# Altium schematic sheet 18-OSPI FLASH AND SPI NOR FLASH.SchDoc
size 513 x 386 mm
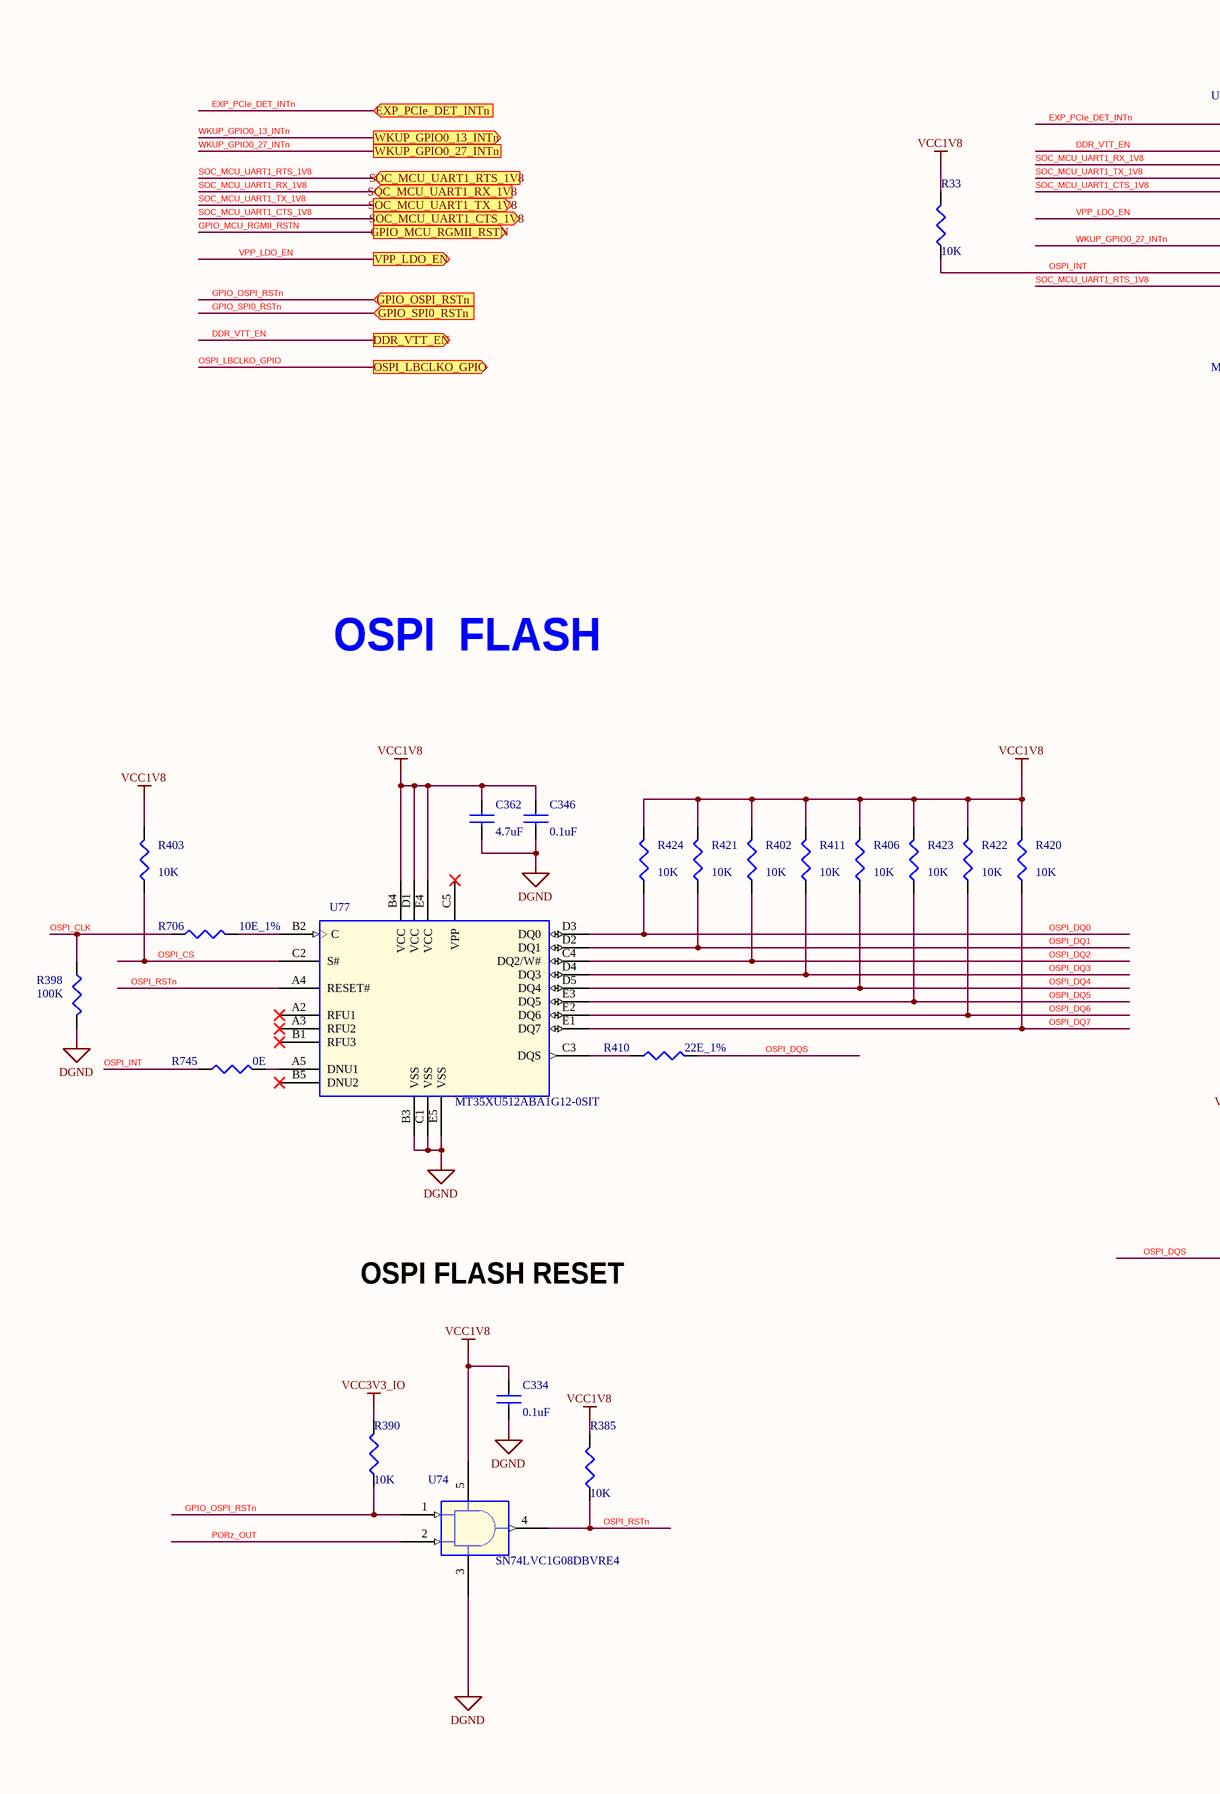
[diagram p0: 18-OSPI FLASH AND SPI NOR FLASH.SchDoc, left]
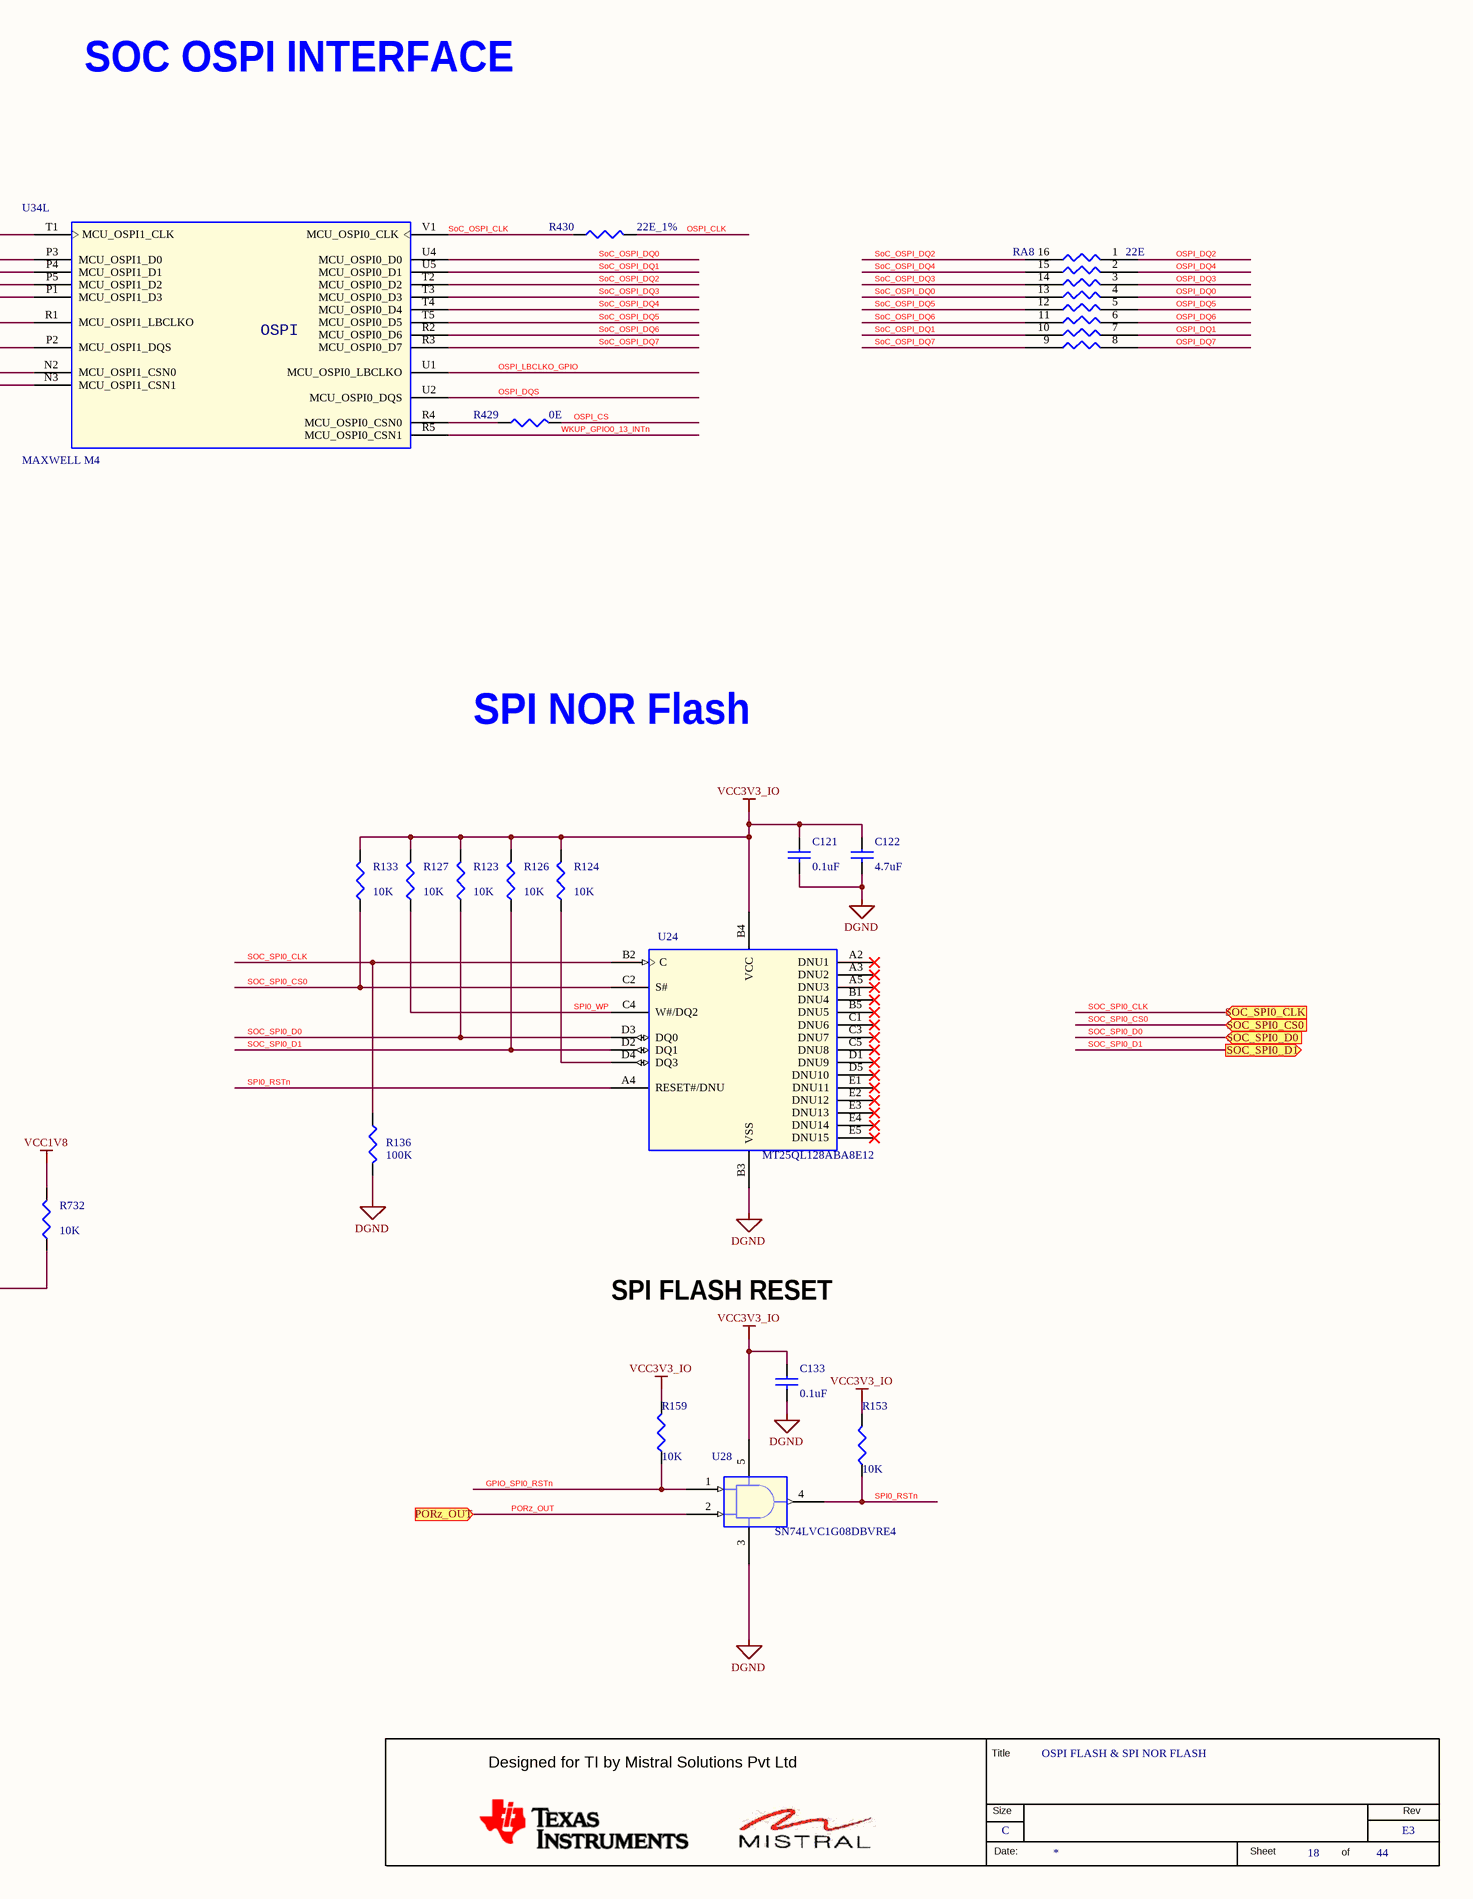
[diagram p1: 18-OSPI FLASH AND SPI NOR FLASH.SchDoc, right]

## Parts
*  RevCode: E3  Title: OSPI FLASH & SPI NOR FLASH  Page Size: C  Page Number: 18  Page Count: 44  (hidden comment: MISTRAL_TITLEBLK_CSIZE)  (graphical)
C121  0.1uF  [CAP0201_0-5]
C122  4.7uF  [CAP0402_0-75]
C133  0.1uF  [CAP0201_0-5]
C334  0.1uF  [CAP0201_0-5]
C346  0.1uF  [CAP0201_0-5]
C362  4.7uF  [CAP0402_0-75]
R33  10K  [RES0402_0-5]
R123  10K  [RES0402_0-5]
R124  10K  [RES0402_0-5]
R126  10K  [RES0402_0-5]
R127  10K  [RES0402_0-5]
R133  10K  [RES0402_0-5]
R136  100K  [RES0402_0-5]
R153  10K  [RES0402_0-5]
R159  10K  [RES0402_0-5]
R385  10K  [RES0402_0-5]
R390  10K  [RES0402_0-5]
R398  100K  [RES0402_0-5]
R402  10K  [RES0402_0-5]
R403  10K  [RES0402_0-5]
R406  10K  [RES0402_0-5]
R410  22E_1%  [RES0402]
R411  10K  [RES0402_0-5]
R420  10K  [RES0402_0-5]
R421  10K  [RES0402_0-5]
R422  10K  [RES0402_0-5]
R423  10K  [RES0402_0-5]
R424  10K  [RES0402_0-5]
R429  0E  [RES0402_0-5]
R430  22E_1%  [RES0402]
R706  10E_1%  [RES0402_0-5]
R732  10K  [RES0402_0-5]
R745  0E  [RES0402_0-5]
RA8  22E  [RESA_0402-8]
U24  MT25QL128ABA8E12  [TPBGA24_39-37_240X320_1-2]
U28  SN74LVC1G08DBVRE4  [SOT23-5]
U34  MAXWELL M4  [BGA784_31-49_910X910_1-7]  (part L of 19)
U74  SN74LVC1G08DBVRE4  [SOT23-5]
U77  MT35XU512ABA1G12-0SIT  [TPBGA24_39-37_240X320_1-2]

## Ports
DDR_VTT_EN (out), EXP_PCIe_DET_INTn (in), GPIO_MCU_RGMII_RSTN (out), GPIO_OSPI_RSTn (in), GPIO_SPI0_RSTn (in), OSPI_LBCLKO_GPIO (out), PORz_OUT (in), SOC_MCU_UART1_CTS_1V8 (out), SOC_MCU_UART1_RTS_1V8 (in), SOC_MCU_UART1_RX_1V8 (in), SOC_MCU_UART1_TX_1V8 (out), SOC_SPI0_CLK (in), SOC_SPI0_CS0 (in), SOC_SPI0_D0 (in), SOC_SPI0_D1 (out), VPP_LDO_EN (out), WKUP_GPIO0_13_INTn (out), WKUP_GPIO0_27_INTn

## Nets
DGND: C121.2 C122.2 C133.2 C334.2 C346.2 C362.2 R136.2 R398.2 U24.B3(VSS) U28.3(GND) U74.3(GND) U77.B3(VSS) U77.C1(VSS) U77.E5(VSS)
VCC1V8: C334.1 C346.1 C362.1 R33.2 R385.2 R402.2 R403.2 R406.2 R411.2 R420.2 R421.2 R422.2 R423.2 R424.2 R732.2 U74.5(VCC) U77.B4(VCC) U77.D1(VCC) U77.E4(VCC)
VCC3V3_IO: C121.1 C122.1 C133.1 R123.2 R124.2 R126.2 R127.2 R133.2 R153.2 R159.2 R390.2 U24.B4(VCC) U28.5(VCC)
DDR_VTT_EN: U34.P3(MCU_OSPI1_D0) ; port DDR_VTT_EN
EXP_PCIe_DET_INTn: U34.T1(MCU_OSPI1_CLK) ; port EXP_PCIe_DET_INTn
GPIO_MCU_RGMII_RSTN: port GPIO_MCU_RGMII_RSTN
GPIO_OSPI_RSTn: R390.1 U74.1(A) ; port GPIO_OSPI_RSTn
GPIO_SPI0_RSTn: R159.1 U28.1(A) ; port GPIO_SPI0_RSTn
OSPI_CLK: R398.1 R430.2 R706.1
OSPI_CS: R403.1 R429.2 U77.C2(S#)
OSPI_DQ0: R424.1 RA8.4 U77.D3(DQ0)
OSPI_DQ1: R421.1 RA8.7 U77.D2(DQ1)
OSPI_DQ2: R402.1 RA8.1 U77.C4(DQ2/W#)
OSPI_DQ3: R411.1 RA8.3 U77.D4(DQ3)
OSPI_DQ4: R406.1 RA8.2 U77.D5(DQ4)
OSPI_DQ5: R423.1 RA8.5 U77.E3(DQ5)
OSPI_DQ6: R422.1 RA8.6 U77.E2(DQ6)
OSPI_DQ7: R420.1 RA8.8 U77.E1(DQ7)
OSPI_DQS: R410.2 R732.1 U34.U2(MCU_OSPI0_DQS)
OSPI_INT: R33.1 R745.1 U34.N2(MCU_OSPI1_CSN0)
OSPI_LBCLKO_GPIO: U34.U1(MCU_OSPI0_LBCLKO) ; port OSPI_LBCLKO_GPIO
OSPI_RSTn: R385.1 U74.4(Y) U77.A4(RESET#)
PORz_OUT: U28.2(B) U74.2(B) ; port PORz_OUT
SOC_MCU_UART1_CTS_1V8: U34.P1(MCU_OSPI1_D3) ; port SOC_MCU_UART1_CTS_1V8
SOC_MCU_UART1_RTS_1V8: U34.N3(MCU_OSPI1_CSN1) ; port SOC_MCU_UART1_RTS_1V8
SOC_MCU_UART1_RX_1V8: U34.P4(MCU_OSPI1_D1) ; port SOC_MCU_UART1_RX_1V8
SOC_MCU_UART1_TX_1V8: U34.P5(MCU_OSPI1_D2) ; port SOC_MCU_UART1_TX_1V8
SoC_OSPI_CLK: R430.1 U34.V1(MCU_OSPI0_CLK)
SoC_OSPI_DQ0: RA8.13 U34.U4(MCU_OSPI0_D0)
SoC_OSPI_DQ1: RA8.10 U34.U5(MCU_OSPI0_D1)
SoC_OSPI_DQ2: RA8.16 U34.T2(MCU_OSPI0_D2)
SoC_OSPI_DQ3: RA8.14 U34.T3(MCU_OSPI0_D3)
SoC_OSPI_DQ4: RA8.15 U34.T4(MCU_OSPI0_D4)
SoC_OSPI_DQ5: RA8.12 U34.T5(MCU_OSPI0_D5)
SoC_OSPI_DQ6: RA8.11 U34.R2(MCU_OSPI0_D6)
SoC_OSPI_DQ7: RA8.9 U34.R3(MCU_OSPI0_D7)
SOC_SPI0_CLK: R136.1 U24.B2(C) ; port SOC_SPI0_CLK
SOC_SPI0_CS0: R133.1 U24.C2(S#) ; port SOC_SPI0_CS0
SOC_SPI0_D0: R123.1 U24.D3(DQ0) ; port SOC_SPI0_D0
SOC_SPI0_D1: R126.1 U24.D2(DQ1) ; port SOC_SPI0_D1
SPI0_RSTn: R153.1 U24.A4(RESET#/DNU) U28.4(Y)
SPI0_WP: R127.1 U24.C4(W#/DQ2)
VPP_LDO_EN: U34.R1(MCU_OSPI1_LBCLKO) ; port VPP_LDO_EN
WKUP_GPIO0_13_INTn: U34.R5(MCU_OSPI0_CSN1) ; port WKUP_GPIO0_13_INTn
WKUP_GPIO0_27_INTn: U34.P2(MCU_OSPI1_DQS) ; port WKUP_GPIO0_27_INTn
NetR124_1: R124.1 U24.D4(DQ3)
NetR410_1: R410.1 U77.C3(DQS)
NetR429_1: R429.1 U34.R4(MCU_OSPI0_CSN0)
NetR706_2: R706.2 U77.B2(C)
NetR745_2: R745.2 U77.A5(DNU1)

Not connected (* = marked no-connect by the designer): U24 A2(DNU1)* A3(DNU2)* A5(DNU3)* B1(DNU4)* B5(DNU5)* C1(DNU6)* C3(DNU7)* C5(DNU8)* D1(DNU9)* D5(DNU10)* E1(DNU11)* E2(DNU12)* E3(DNU13)* E4(DNU14)* E5(DNU15)*; U77 A2(RFU1)* A3(RFU2)* B1(RFU3)* B5(DNU2)* C5(VPP)*

## Notes on the sheet
- SOC OSPI INTERFACE
- OSPI  FLASH
- SPI NOR Flash
- OSPI FLASH RESET
- SPI FLASH RESET
- (in symbol AM654X_BGA784, part L) OSPI
- (in symbol MISTRAL_TITLEBLK_CSIZE) Title; Designed for TI by Mistral Solutions Pvt Ltd; Size; Rev; Date:; Sheet; of

## Library data of the parts
* = MISTRAL_TITLEBLK_CSIZE: Issue: 1.0; Page Create Date: March  8, 1995; Page Modify Date: *
C121 C334 C346 = CAP_Dup5: CAP CERAMIC 0.1uF 16V 10% X5R 0201; Part_type: CAPACITORS\CERAMIC; Mfr_part_number: GRM033R61C104KE84J; Mfr_name: MURATA; Mistral Part No: 120009030072-R; Custom_Duty: 15%; Customs_HS_Code: 85322990; Wattage: NA; Project: TI_MAXIE_CPB; Library Ref: CAP; PCB Footprint: CAP0201_0-5; MECHANICAL 3D STEP FILE: CAP0201_0-5; Chkd/date: MANIRAJA/120218; Crtd /date: MANIRAJA/120218; Datasheet: Y:\MIS_DATABASE\DATASHEETS\CAPACITORS\GRM033R61C104KE84.PDF; Temperature: -55°C+85°C; Weight: 0.33mg; Height: 0.33MM; Distributor_part_number: 490-16742-1-ND; Distributor_name: DIGIKEY; Package: 0201; Voltage: 16V; Tolerance: 10%
C122 = CAP_Dup5: CAP CERAMIC 4.7uF 10V 20% X5R 0402; Mistral Part No: 120012060002-R; Mfr_name: AVX CORPORATION; Mfr_part_number: 0402ZD475MAT2A; Part_type: CAPACITORS\CERAMIC; Project: TI_MAXIE_CPB; Wattage: NA; Customs_HS_Code: 85322990; Custom_Duty: 15%; Library Ref: CAP; PCB Footprint: CAP0402_0-75; Tolerance: 20%; Voltage: 10V; Package: 0402; Distributor_name: DIGIKEY; Distributor_part_number: 478-10791-1-ND; Height: 0.71MM; Weight: 0.65mg; Temperature: -55°C+85°C; Datasheet: Y:\MIS_DATABASE\DATASHEETS\CAPACITORS\AVX_MLC.PDF; Crtd /date: MANIRAJA/230118; Chkd/date: MANIRAJA/230118; MECHANICAL 3D STEP FILE: CAP0402_0-75
C133 = CAP_Dup5: CAP CERAMIC 0.1uF 16V 10% X5R 0201; Mistral Part No: 120009030072-R; Mfr_name: MURATA; Mfr_part_number: GRM033R61C104KE84J; Part_type: CAPACITORS\CERAMIC; Project: TI_MAXIE_CPB; Wattage: NA; Customs_HS_Code: 85322990; Custom_Duty: 15%; Library Ref: CAP; PCB Footprint: CAP0201_0-5; Tolerance: 10%; Voltage: 16V; Package: 0201; Distributor_name: DIGIKEY; Distributor_part_number: 490-16742-1-ND; Height: 0.33MM; Weight: 0.33mg; Temperature: -55°C+85°C; Datasheet: Y:\MIS_DATABASE\DATASHEETS\CAPACITORS\GRM033R61C104KE84.PDF; Crtd /date: MANIRAJA/120218; Chkd/date: MANIRAJA/120218; MECHANICAL 3D STEP FILE: CAP0201_0-5
C362 = CAP_Dup5: CAP CERAMIC 4.7uF 10V 20% X5R 0402; Part_type: CAPACITORS\CERAMIC; Mfr_part_number: 0402ZD475MAT2A; Mfr_name: AVX CORPORATION; Mistral Part No: 120012060002-R; Custom_Duty: 15%; Customs_HS_Code: 85322990; Wattage: NA; Project: TI_MAXIE_CPB; Library Ref: CAP; PCB Footprint: CAP0402_0-75; MECHANICAL 3D STEP FILE: CAP0402_0-75; Chkd/date: MANIRAJA/230118; Crtd /date: MANIRAJA/230118; Datasheet: Y:\MIS_DATABASE\DATASHEETS\CAPACITORS\AVX_MLC.PDF; Temperature: -55°C+85°C; Weight: 0.65mg; Height: 0.71MM; Distributor_part_number: 478-10791-1-ND; Distributor_name: DIGIKEY; Package: 0402; Voltage: 10V; Tolerance: 20%
R33 R124 R126 R127 R159 R385 R403 = RESISTOR_Dup5: RES 10K 1/16W 5% 0402; Part_type: RESISTORS\FIXED; Mfr_part_number: RC0402JR-0710KL; Mfr_name: YAGEO AMERICA; Mistral Part No: 110009030208-R; Custom_Duty: 15%; Customs_HS_Code: 85332119; Voltage: NA; Project: HSE; Footprint Path: Y:\MIS_DATABASE\Library\ALTIUM_TOOL\PCB_FOOTPRINTS\Altium_Footprint_Lib.PcbLib; Library Path: Y:\MIS_DATABASE\Library\ALTIUM_TOOL\SCHEMATICS_PARTS\MS_DISCRETE_Library.schlib; Footprint Ref: RES0402_0-5; Library Ref: RESISTOR; PCB Footprint: RES0402_0-5; MECHANICAL 3D STEP FILE: RES0402_0-5; RoHS: Pb-Free; Chkd/date: VASANTHA/061216; Crtd /date: MAZHAR/230805; Datasheet: Y:\MIS_DATABASE\DATASHEETS\RESISTORS\YAGEO-RC0402.PDF; Temperature: -55°C+155°C; Weight: 0.65mg; Height: 0.40MM; Distributor_part_number: 311-10KJRCT-ND; Distributor_name: DIGIKEY; Package: 0402; Wattage: 1/16W; Tolerance: 5%
R123 R133 R153 R390 R402 = RESISTOR_Dup5: RES 10K 1/16W 5% 0402; Mistral Part No: 110009030208-R; Mfr_name: YAGEO AMERICA; Mfr_part_number: RC0402JR-0710KL; Part_type: RESISTORS\FIXED; Project: HSE; Voltage: NA; Customs_HS_Code: 85332119; Custom_Duty: 15%; Footprint Path: Y:\MIS_DATABASE\Library\ALTIUM_TOOL\PCB_FOOTPRINTS\Altium_Footprint_Lib.PcbLib; Library Path: Y:\MIS_DATABASE\Library\ALTIUM_TOOL\SCHEMATICS_PARTS\MS_DISCRETE_Library.schlib; Footprint Ref: RES0402_0-5; Library Ref: RESISTOR; Tolerance: 5%; Wattage: 1/16W; Package: 0402; Distributor_name: DIGIKEY; Distributor_part_number: 311-10KJRCT-ND; Height: 0.40MM; Weight: 0.65mg; Temperature: -55°C+155°C; Datasheet: Y:\MIS_DATABASE\DATASHEETS\RESISTORS\YAGEO-RC0402.PDF; Crtd /date: MAZHAR/230805; Chkd/date: VASANTHA/061216; RoHS: Pb-Free; MECHANICAL 3D STEP FILE: RES0402_0-5; PCB Footprint: RES0402_0-5
R136 R398 = RESISTOR_Dup4: RES 100K 1/16W 5% 0402; Mistral Part No: 110011060002-R; Mfr_name: VISHAY; Mfr_part_number: CRCW0402100KJNED; Part_type: RESISTORS\FIXED; Project: AM4515_EVM_LCD; Voltage: NA; Customs_HS_Code: 85332119; Custom_Duty: 15%; Library Ref: RESISTOR; Tolerance: 5%; Wattage: 1/16W; Package: 0402; Distributor_name: DIGIKEY; Distributor_part_number: 541-100KJCT-ND; Height: 0.40MM; Weight: 0.65mg; Temperature: -55°C+155°C; Datasheet: Y:\MIS_DATABASE\DATASHEETS\RESISTORS\CRCW0603.PDF; Crtd /date: BAVISH/010611; Chkd/date: VASANTHA/061216; PCB Footprint: RES0402_0-5; MECHANICAL 3D STEP FILE: RES0402_0-5
R406 R420 R423 = RESISTOR_Dup5: RES 10K 1/16W 5% 0402; Mistral Part No: 110009030208-R; Mfr_name: YAGEO AMERICA; Mfr_part_number: RC0402JR-0710KL; Part_type: RESISTORS\FIXED; Project: HSE; Voltage: NA; Customs_HS_Code: 85332119; Custom_Duty: 15%; NI_MARK: DNI; Footprint Path: Y:\MIS_DATABASE\Library\ALTIUM_TOOL\PCB_FOOTPRINTS\Altium_Footprint_Lib.PcbLib; Library Path: Y:\MIS_DATABASE\Library\ALTIUM_TOOL\SCHEMATICS_PARTS\MS_DISCRETE_Library.schlib; Footprint Ref: RES0402_0-5; Library Ref: RESISTOR; PCB Footprint: RES0402_0-5; Tolerance: 5%; Wattage: 1/16W; Package: 0402; Distributor_name: DIGIKEY; Distributor_part_number: 311-10KJRCT-ND; Height: 0.40MM; Weight: 0.65mg; Temperature: -55°C+155°C; Datasheet: Y:\MIS_DATABASE\DATASHEETS\RESISTORS\YAGEO-RC0402.PDF; Crtd /date: MAZHAR/230805; Chkd/date: VASANTHA/061216; RoHS: Pb-Free; MECHANICAL 3D STEP FILE: RES0402_0-5
R410 = RESISTOR_Dup4: RES 22E 1/16W 1% 0402; Mistral Part No: 110009090004-P; Mfr_name: YAGEO AMERICA; Mfr_part_number: RC0402FR-0722RL; Part_type: RESISTORS\FIXED; Alternate_mfr_name_A: VISHAY; Alternate_mfr_part_number_A: CRCW040222R0FKED; Cust_part_number: 4700-80047E; SIGNAL_MODEL: RESISTOR_RES0402_22E_22E; Project: VMEFMCD; Voltage: 50V; Customs_HS_Code: 85332119; Custom_Duty: 15%; Remarks: In alternate datasheet it is RoHS COMPLIANT. Y:\MIS_DATABASE\DATASHEETS\RESISTORS\CRCW0402.PDF; Library Ref: RESISTOR; PCB Footprint: RES0402; Tolerance: 1%; Wattage: 1/16W; Package: 0402; Distributor_name: DIGIKEY; Distributor_part_number: 311-22.0LRCT-ND; Distributor_name_A: DIGIKEY; Distributor_part_number_A: 541-22.0LCT-ND; Height: 0.40MM; Weight: 0.8g/1000pcs; Temperature: -55°C+155°C; Datasheet: Y:\MIS_DATABASE\DATASHEETS\RESISTORS\YAGEO-RC0402.PDF; Crtd /date: MAZHAR/090909; Chkd/date: SUHAS/290910; RoHS: Pb-Free
R411 R421 R422 R424 R732 = RESISTOR_Dup5: RES 10K 1/16W 5% 0402; Part_type: RESISTORS\FIXED; Mfr_part_number: RC0402JR-0710KL; Mfr_name: YAGEO AMERICA; Mistral Part No: 110009030208-R; Custom_Duty: 15%; Customs_HS_Code: 85332119; Voltage: NA; Project: HSE; NI_MARK: DNI; Footprint Path: Y:\MIS_DATABASE\Library\ALTIUM_TOOL\PCB_FOOTPRINTS\Altium_Footprint_Lib.PcbLib; Library Path: Y:\MIS_DATABASE\Library\ALTIUM_TOOL\SCHEMATICS_PARTS\MS_DISCRETE_Library.schlib; Footprint Ref: RES0402_0-5; Library Ref: RESISTOR; PCB Footprint: RES0402_0-5; MECHANICAL 3D STEP FILE: RES0402_0-5; RoHS: Pb-Free; Chkd/date: VASANTHA/061216; Crtd /date: MAZHAR/230805; Datasheet: Y:\MIS_DATABASE\DATASHEETS\RESISTORS\YAGEO-RC0402.PDF; Temperature: -55°C+155°C; Weight: 0.65mg; Height: 0.40MM; Distributor_part_number: 311-10KJRCT-ND; Distributor_name: DIGIKEY; Package: 0402; Wattage: 1/16W; Tolerance: 5%
R429 R745 = RESISTOR_Dup4: RES 0E 1/16W 0402; Mistral Part No: 110010080019-P; Mfr_name: VISHAY; Mfr_part_number: CRCW04020000Z0ED; Part_type: RESISTORS\FIXED; Project: PB_BUGBASE; Tolerance: NA; Customs_HS_Code: 85332119; Custom_Duty: 15%; Footprint Path: Y:\MIS_DATABASE\Library\ALTIUM_TOOL\PCB_FOOTPRINTS\Altium_Footprint_Lib.PcbLib; Library Path: Y:\MIS_DATABASE\Library\ALTIUM_TOOL\SCHEMATICS_PARTS\MS_DISCRETE_Library.schlib; Footprint Ref: RES0402_0-5; Library Ref: RESISTOR; PCB Footprint: RES0402_0-5; Voltage: NA; Wattage: 1/16W; Package: 0402; Distributor_name: DIGIKEY; Distributor_part_number: 541-0.0JCT-ND; Height: 0.40MM; Weight: 0.65g/1000pcs; Temperature: -55°C+155°C; Datasheet: Y:\MIS_DATABASE\DATASHEETS\RESISTORS\CRCW0603.PDF; Crtd /date: MUDDU/190810; Chkd/date: VASANTHA/201216; RoHS: Pb-Free; MECHANICAL 3D STEP FILE: RES0402_0-5
R430 = RESISTOR_Dup4: RES 22E 1/16W 1% 0402; Cust_part_number: 4700-80047E; Alternate_mfr_part_number_A: CRCW040222R0FKED; Alternate_mfr_name_A: VISHAY; Part_type: RESISTORS\FIXED; Mfr_part_number: RC0402FR-0722RL; Mfr_name: YAGEO AMERICA; Mistral Part No: 110009090004-P; Remarks: In alternate datasheet it is RoHS COMPLIANT. Y:\MIS_DATABASE\DATASHEETS\RESISTORS\CRCW0402.PDF; Custom_Duty: 15%; Customs_HS_Code: 85332119; Voltage: 50V; Project: VMEFMCD; SIGNAL_MODEL: RESISTOR_RES0402_22E_22E; Library Ref: RESISTOR; RoHS: Pb-Free; Chkd/date: SUHAS/290910; Crtd /date: MAZHAR/090909; Datasheet: Y:\MIS_DATABASE\DATASHEETS\RESISTORS\YAGEO-RC0402.PDF; Temperature: -55°C+155°C; Weight: 0.8g/1000pcs; Height: 0.40MM; Distributor_part_number_A: 541-22.0LCT-ND; Distributor_name_A: DIGIKEY; Distributor_part_number: 311-22.0LRCT-ND; Distributor_name: DIGIKEY; Package: 0402; Wattage: 1/16W; Tolerance: 1%; PCB Footprint: RES0402
R706 = RESISTOR_Dup2: RES 10E 1/16W 1% 0402; Part_type: RESISTORS\FIXED; Mfr_part_number: RC0402FR-0710RL; Mfr_name: YAGEO AMERICA; Mistral Part No: 110018020004-R; Custom_Duty: 15%; Customs_HS_Code: 85332119; Project: TI_MAXIE_CPB; Voltage: NA; Library Ref: RESISTOR; PCB Footprint: RES0402_0-5; Chkd/date: MANIRAJA/070218; Crtd /date: ALVY/070218; Datasheet: Y:\MIS_DATABASE\DATASHEETS\RESISTORS\YAGEO-RC0402.PDF; Height: 0.40MM; Distributor_part_number: 311-10.0LRCT-ND; Distributor_name: DIGIKEY; Package: 0402; Wattage: 1/16W; Tolerance: 1%; Weight: 0.65mg; Temperature: -55°C+155°C; MECHANICAL 3D STEP FILE: RES0402_0-5
RA8 = RESARR_ISO8: RES ARRAY 22E 62.5mW 5% 0402; Part_type: RESISTORS\ARRAY; Mfr_part_number: 741X163220JP; Mfr_name: CTS; Mistral Part No: 110009030020-R; Wattage: 63mW; Project: CPB; SIGNAL_MODEL: RESARR_ISO8_RESA_0402-8_22E_22E; Library Ref: RESARR_ISO8; Chkd/date: MAZHAR/040809; Crtd /date: USMAN/040908; Datasheet: Y:\MIS_DATABASE\DATASHEETS\RESISTORS\741-6SER.PDF; Height: 0.55MM; Distributor_part_number: 741X163220JPCT-ND; Distributor_name: DIGIKEY; Package: 0402; Tolerance: 5%; PCB Footprint: RESA_0402-8
U24 = MT25QL02GCBB8E12_TPBGA24: IC 128Mb SERIAL NOR FLASH MEMORY TPBGA24; Mistral Part No: 141117090006-R; Mfr_name: MICRON; Mfr_part_number: MT25QL128ABA8E12-0SIT; Part_type: ICS\DIGITAL\MEMORY; Project: TI_SVB_MAXWELL_FMB; Tolerance: NA; Customs_HS_Code: 85423100; Custom_Duty: 15%; Library Ref: MT25QL02GCBB8E12_TPBGA24; PCB Footprint: TPBGA24_39-37_240X320_1-2; Voltage: NA; Wattage: NA; Package: TPBGA24; Distributor_name: DIGIKEY; Distributor_part_number: MT25QL128ABA8E12-0SIT-ND; Height: 1.20MM; Weight: NA; Temperature: -40°C+85°C; Datasheet: Y:\MIS_DATABASE\DATASHEETS\ICS\MEMORY\MT25QLXXX.PDF; Crtd /date: MANIRAJA/110917; Chkd/date: MANIRAJA/110917; MECHANICAL 3D STEP FILE: TPBGA24_39-37_240X320_1-2
U28 = SN74LVC1G08DBVRE4_SOT23-5: IC SINGLE 2-INPUT POSITIVE AND GATE SOT23-5; Part_type: ICS\DIGITAL\GATES; Mfr_name: TEXAS INSTRUMENTS; Mistral Part No: 141009060026-R; Custom_Duty: 15%; Customs_HS_Code: 85423100; Project: KHAN_MAIN; Library Ref: SN74LVC1G08DBVRE4_SOT23-5; PCB Footprint: SOT23-5; RoHS: Sb/ Br FREE; Chkd/date: SUHAS/221010; Crtd /date: USMAN/151008; Datasheet: Y:\MIS_DATABASE\DATASHEETS\ICS\DIGITAL\GATES\SN74LVC1G08.PDF; Temperature: -40°C+85°C; Height: 1.45MM; Distributor_part_number: SN74LVC1G08DBVRE4-ND; Distributor_name: DIGIKEY; Package: SOT23-5; Mfr_part_number: SN74LVC1G08DBVRE4
U34 = AM654X_BGA784: IC MAXWELL MICRO CONTROLLER UNIT BGA784; Mistral Part No: 141217100003; Mfr_name: TEXAS INSTRUMENTS; Mfr_part_number: MAXWELL M4_EVM; Part_type: ICS\DIGITAL\MICROCONTROLLER; Project: TI_MAXIE_CPB; Tolerance: NA; Customs_HS_Code: 85423100; Custom_Duty: 15%; Library Ref: AM654X_BGA784; Voltage: NA; Wattage: NA; Package: BGA784; Distributor_name: NA; Distributor_part_number: NA; Height: 1.63MM; Weight: NA; Temperature: NA; Datasheet: Y:\MIS_DATABASE\DATASHEETS\ICS\DIGITAL\MICROCONTROLLER\MAXWELLM4.PDF; Crtd /date: MANIRAJA/130717; Chkd/date: MANIRAJA/130717; MECHANICAL 3D STEP FILE: BGA784_31-49_910X910_1-7; PCB Footprint: BGA784_31-49_910X910_1-7
U74 = SN74LVC1G08DBVRE4_SOT23-5: IC SINGLE 2-INPUT POSITIVE AND GATE SOT23-5; Mistral Part No: 141009060026-R; Mfr_name: TEXAS INSTRUMENTS; Part_type: ICS\DIGITAL\GATES; Project: KHAN_MAIN; Customs_HS_Code: 85423100; Custom_Duty: 15%; Library Ref: SN74LVC1G08DBVRE4_SOT23-5; PCB Footprint: SOT23-5; Mfr_part_number: SN74LVC1G08DBVRE4; Package: SOT23-5; Distributor_name: DIGIKEY; Distributor_part_number: SN74LVC1G08DBVRE4-ND; Height: 1.45MM; Temperature: -40°C+85°C; Datasheet: Y:\MIS_DATABASE\DATASHEETS\ICS\DIGITAL\GATES\SN74LVC1G08.PDF; Crtd /date: USMAN/151008; Chkd/date: SUHAS/221010; RoHS: Sb/ Br FREE
U77 = MT35XU512ABA1G12_TPBGA24: IC 512Mb XCCELA FLASH MEMORY TPBGA24; Part_type: ICS\DIGITAL\MEMORY; Mfr_name: MICRON; Mistral Part No: 141117080009-R; Custom_Duty: 15%; Customs_HS_Code: 85423100; Wattage: NA; Project: TI_MAXIE_CPB; MECHANICAL 3D STEP FILE: TPBGA24_39-37_240X320_1-2; Chkd/date: MANIRAJA/240817; Crtd /date: MANIRAJA/240817; Datasheet: Y:\MIS_DATABASE\DATASHEETS\ICS\MEMORY\MT35XU5XX.PDF; Temperature: -40°C+85°C; Weight: NA; Height: 1.20MM; Distributor_part_number: NA; Distributor_name: NA; Package: TPBGA24; Voltage: NA; Tolerance: NA; Mfr_part_number: MT35XU512ABA1G12-0SIT; Library Ref: MT35XU512ABA1G12_TPBGA24; PCB Footprint: TPBGA24_39-37_240X320_1-2